# EAGLE design hardware (EAGLE 5.11)
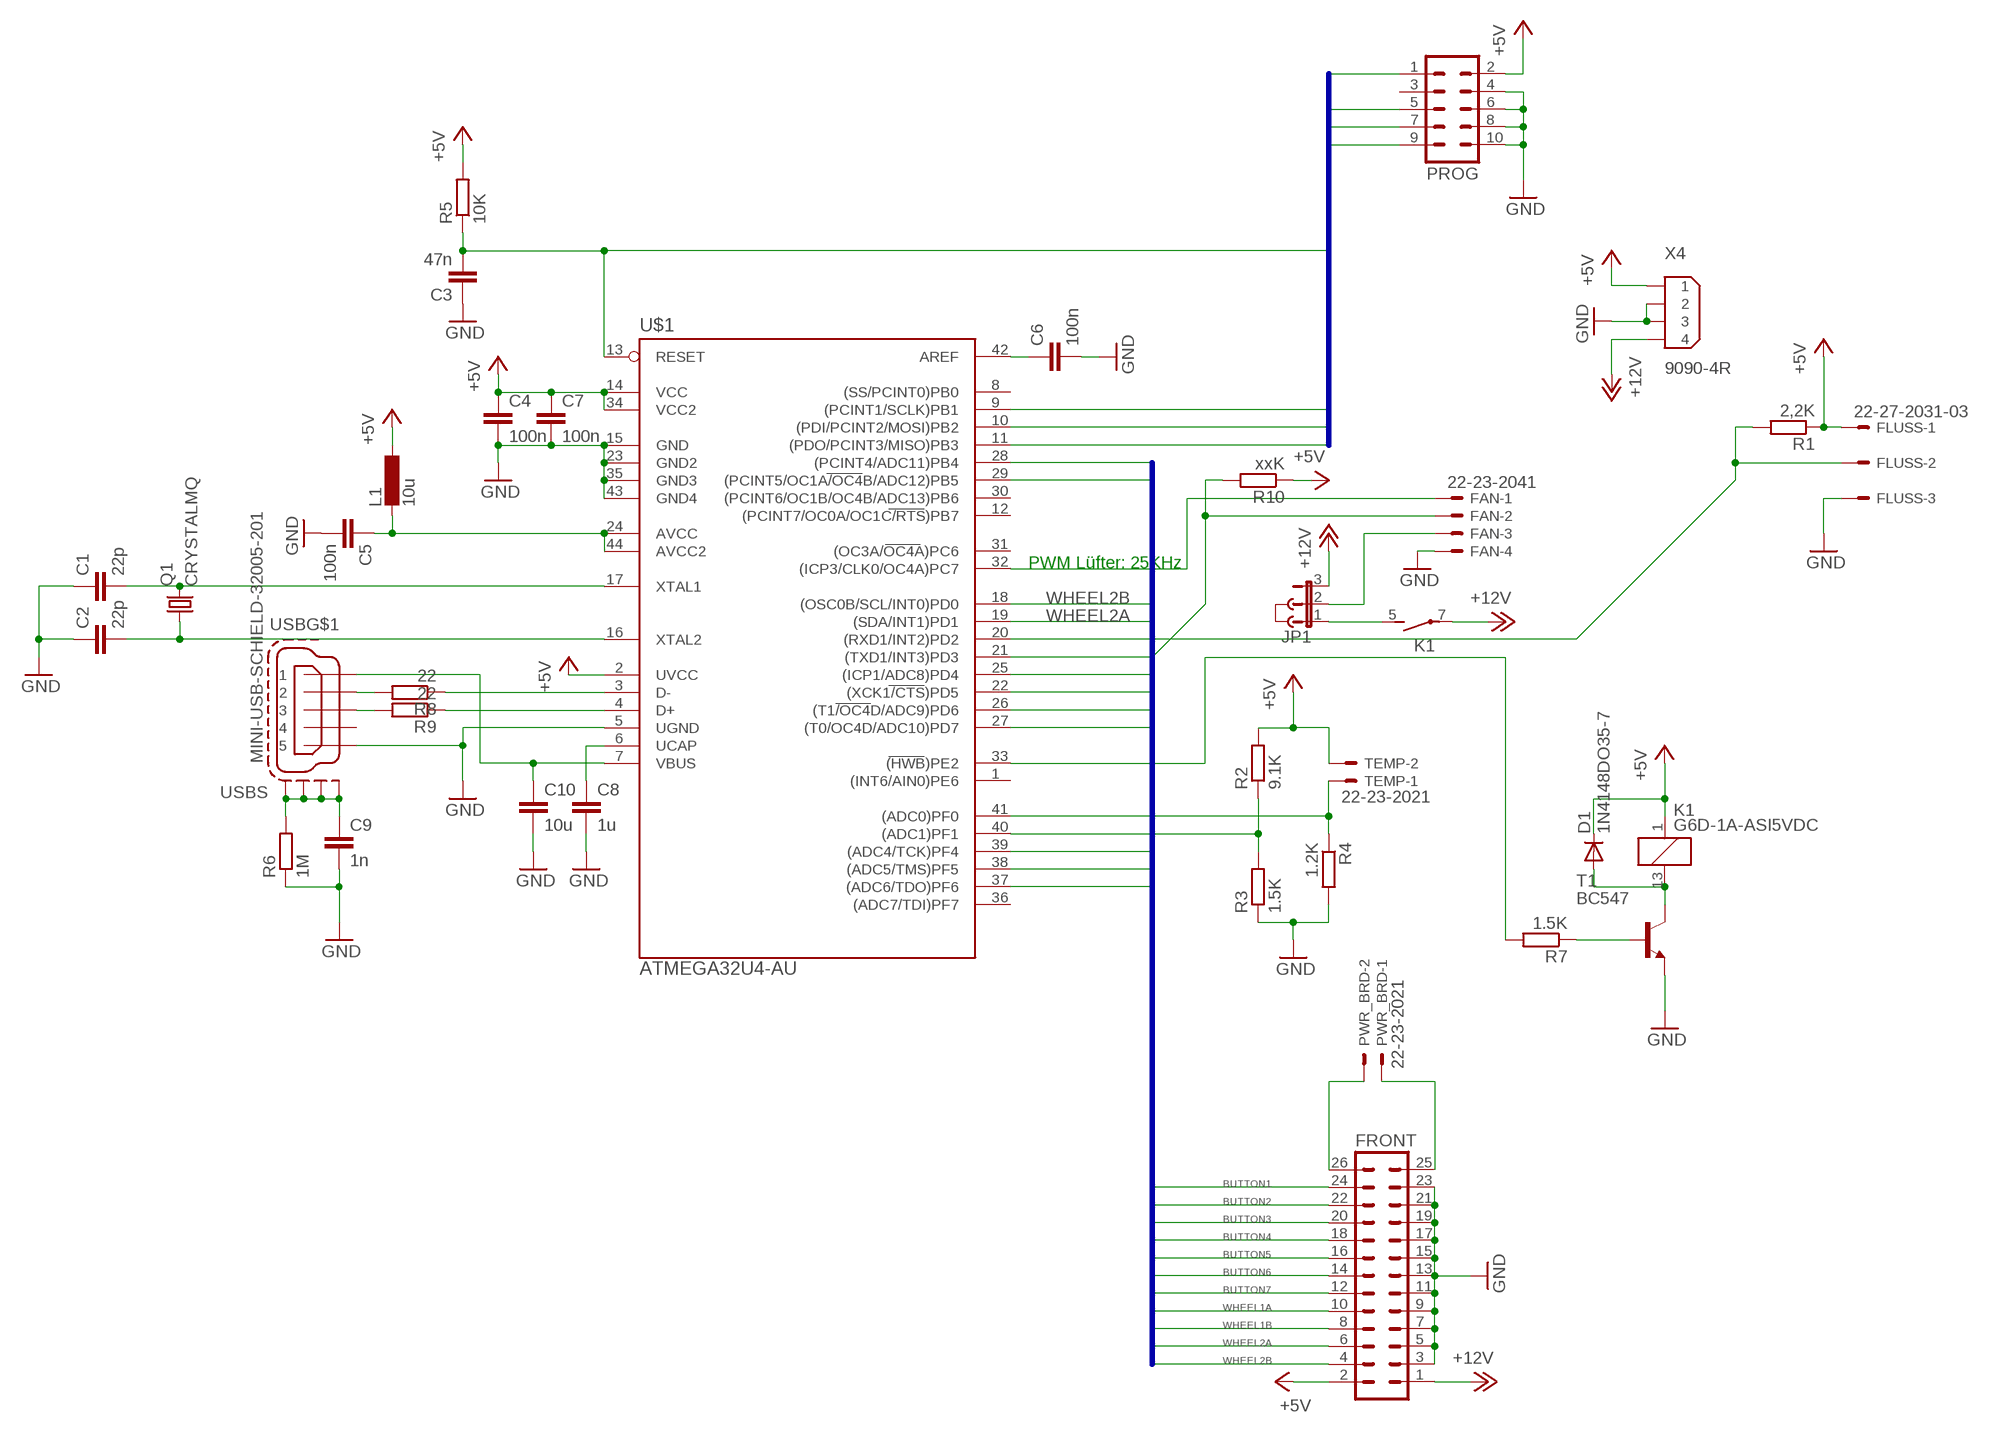
[diagram p0: schematic, sheet 1]

## Parts
C1  22p  C-EUC0603K  [C0603K]
C2  22p  C-EUC0603K  [C0603K]
C3  47n  C-EUC0603  [C0603]
C4  100n  C-EUC0603  [C0603]
C5  100n  C-EUC0603  [C0603]
C6  100n  C-EUC0603  [C0603]
C7  100n  C-EUC0603  [C0603]
C8  1u  C-EUC0603  [C0603]
C9  1n  C-EUC0603  [C0603]
C10  10u  C-EUC0603  [C0603]
D1  1N4148DO35-7  [DO35-7]
FAN  22-23-2041  [22-23-2041]
FLUSS  22-27-2031-03  [6410-03]
FRONT  ML26  [ML26]
J1  JUMPER  [JUMP]
JP1  JP2E  [JP2]
K1  G6D-1A-ASI5VDC  [G6D]
L1  10u  L-EUL2012C  [L2012C]
PROG  ML10  [ML10]
PWR_BRD  22-23-2021  [22-23-2021]
Q1  CRYSTALMQ  [MQ]
R1  2,2K  R-EU_R0603  [R0603]
R2  9.1K  R-EU_R0603  [R0603]
R3  1.5K  R-EU_R0603  [R0603]
R4  1.2K  R-EU_R0603  [R0603]
R5  10K  R-EU_R0603  [R0603]
R6  1M  R-EU_R0603  [R0603]
R7  1.5K  R-EU_R0603  [R0603]
R8  22  R-EU_R0603  [R0603]
R9  22  R-EU_R0603  [R0603]
R10  xxK  R-EU_R0603  [R0603]
T1  BC547  [TO92]
TEMP  22-23-2021  [22-23-2021]
U$1  ATMEGA32U4-AU  [TQFP44]
USB  MINI-USB-SCHIELD-32005-201  [32005-201]
X4  9090-4R  [9090-4R]

## Nets
+5V: C4.1 C7.1 D1.C FLUSS.1 FRONT.2 K1.1 L1.1 PROG.2 R1.1 R2.2 R5.2 R10.1 TEMP.2 U$1.2(UVCC) U$1.14(VCC) U$1.34(VCC2) X4.1
+12V: FRONT.1 JP1.3 K1.7(2:P) X4.4
BUTTON1: FRONT.24 U$1.39((ADC4/TCK)PF4)
BUTTON2: FRONT.22 U$1.38((ADC5/TMS)PF5)
BUTTON3: FRONT.20 U$1.37((ADC6/TDO)PF6)
BUTTON4: FRONT.18 U$1.27((T0/OC4D/ADC10)PD7)
BUTTON5: FRONT.16 U$1.26((T1/OC4D/ADC9)PD6)
BUTTON6: FRONT.14 U$1.25((ICP1/ADC8)PD4)
BUTTON7: FRONT.12 U$1.22((XCK1/CTS)PD5)
GND: C1.1 C2.1 C3.1 C4.2 C5.2 C6.2 C7.2 C8.2 C9.2 C10.2 FAN.4 FLUSS.3 FRONT.3 FRONT.5 FRONT.7 FRONT.9 FRONT.11 FRONT.13 FRONT.15 FRONT.17 FRONT.19 FRONT.21 FRONT.23 PROG.4 PROG.6 PROG.8 PROG.10 R3.1 R4.2 R6.1 T1.1(E) U$1.5(UGND) U$1.15(GND) U$1.23(GND2) U$1.35(GND3) U$1.43(GND4) USB.5 X4.2 X4.3
MISO: PROG.9 U$1.11((PDO/PCINT3/MISO)PB3)
MOSI: PROG.1 U$1.10((PDI/PCINT2/MOSI)PB2)
N$1: C1.2 Q1.P$3 U$1.17(XTAL1)
N$2: C2.2 Q1.P$1 U$1.16(XTAL2)
N$3: R4.1 TEMP.1 U$1.41((ADC0)PF0)
N$4: C5.1 L1.2 U$1.24(AVCC) U$1.44(AVCC2)
N$5: FAN.1 U$1.32((ICP3/CLK0/OC4A)PC7)
N$6: R2.1 R3.2 U$1.40((ADC1)PF1)
N$7: C6.1 U$1.42(AREF)
N$8: C9.1 R6.2 USB.M1(S:S1) USB.M2(S:S2) USB.M3(S:S3) USB.M4(S:S4)
N$9: C10.1 U$1.7(VBUS) USB.1
N$10: R8.2 USB.2
N$11: R9.2 USB.3
N$12: FAN.2 R10.2 U$1.21((TXD1/INT3)PD3)
N$13: C8.1 U$1.6(UCAP)
N$14: FLUSS.2 R1.2 U$1.20((RXD1/INT2)PD2)
N$15: FRONT.25 PWR_BRD.1
N$16: FRONT.26 PWR_BRD.2
N$17: R7.2 U$1.33((HWB)PE2)
N$18: R7.1 T1.2(B)
N$19: D1.A K1.13 T1.3(C)
N$20: FAN.3 JP1.2
N$21: JP1.1 K1.5(2:S)
N$22: R8.1 U$1.3(D-)
N$23: R9.1 U$1.4(D+)
RESET: C3.2 PROG.5 R5.1 U$1.13(RESET)
SCK: PROG.7 U$1.9((PCINT1/SCLK)PB1)
WHEEL1A: FRONT.10 U$1.28((PCINT4/ADC11)PB4)
WHEEL1B: FRONT.8 U$1.29((PCINT5/OC1A/OC4B/ADC12)PB5)
WHEEL2A: FRONT.6 U$1.19((SDA/INT1)PD1)
WHEEL2B: FRONT.4 U$1.18((OSC0B/SCL/INT0)PD0)
Unconnected: PROG.3 Q1.P$2(GND) Q1.P$4(GND1) U$1.1((INT6/AIN0)PE6) U$1.8((SS/PCINT0)PB0) U$1.12((PCINT7/OC0A/OC1C/RTS)PB7) U$1.30((PCINT6/OC1B/OC4B/ADC13)PB6) U$1.31((OC3A/OC4A)PC6) U$1.36((ADC7/TDI)PF7) USB.4

## Buses
PROGAMMIERADAPTER:MOSI,MISO,SCK,RESET
SCHALTER:WHEEL1A,WHEEL1B,WHEEL2A,WHEEL2B,BUTTON[1..7]

## Notes on the sheet
- PWM Lüfter: 25KHz

## Library data of the parts
C1-C10 = rcl:C-EU: CAPACITOR, European symbol
D1 = diode:1N4148: DIODE high speed (Philips)
FAN = con-molex:22-23-2041: .100" (2.54mm) Center Header - 4 Pin; MF: MOLEX; MPN: 22-23-2041; OC_FARNELL: 1462920; OC_NEWARK: 38C0355
FLUSS = con-molex:22-?-03: CONNECTOR wire to board 2.54 mm (.1 inch) pitch header; OC_FARNELL: unknown; OC_NEWARK: unknown
FRONT = con-harting-ml:ML26: HARTING; OC_FARNELL: unknown; OC_NEWARK: unknown
J1 = jumper:JUMPER: JUMPER header
JP1 = jumper:JP2E: JUMPER
K1 = relay:G6D?*: OMRON Slim, Miniature PCB Relay 17.5 × 6.5 × 12.5 mm with Socked Source: http://ecb.omron.com.sg/pdf/relay/power/G6D.pdf; OC_FARNELL: 9812660; OC_NEWARK: unknown
L1 = rcl:L-EU: INDUCTOR, European symbol
PROG = con-harting-ml:ML10: HARTING; OC_FARNELL: unknown; OC_NEWARK: unknown
PWR_BRD TEMP = con-molex:22-23-2021: .100" (2.54mm) Center Header - 2 Pin; MF: MOLEX; MPN: 22-23-2021; OC_FARNELL: 1462926; OC_NEWARK: 25C3832
Q1 = Crystals-new:CRYSTAL
R1-R10 = rcl:R-EU_: RESISTOR, European symbol
T1 = transistor:BC547: NPN TRANSISTOR
U$1 = mega32U4:ATMEGA32U4-AU
USB = con-cypressindustries:MINI-USB-SCHIELD-: MINI USB-B Conector Source: www.cypressindustries.com; OC_FARNELL: unknown; OC_NEWARK: unknown
X4 = con-thomas-betts:9090-4: Disk Drive Power four position Source: Thomas & Betts Electronic Interconnects Eiropean Edition 1998; OC_FARNELL: unknown; OC_NEWARK: unknown

## Board
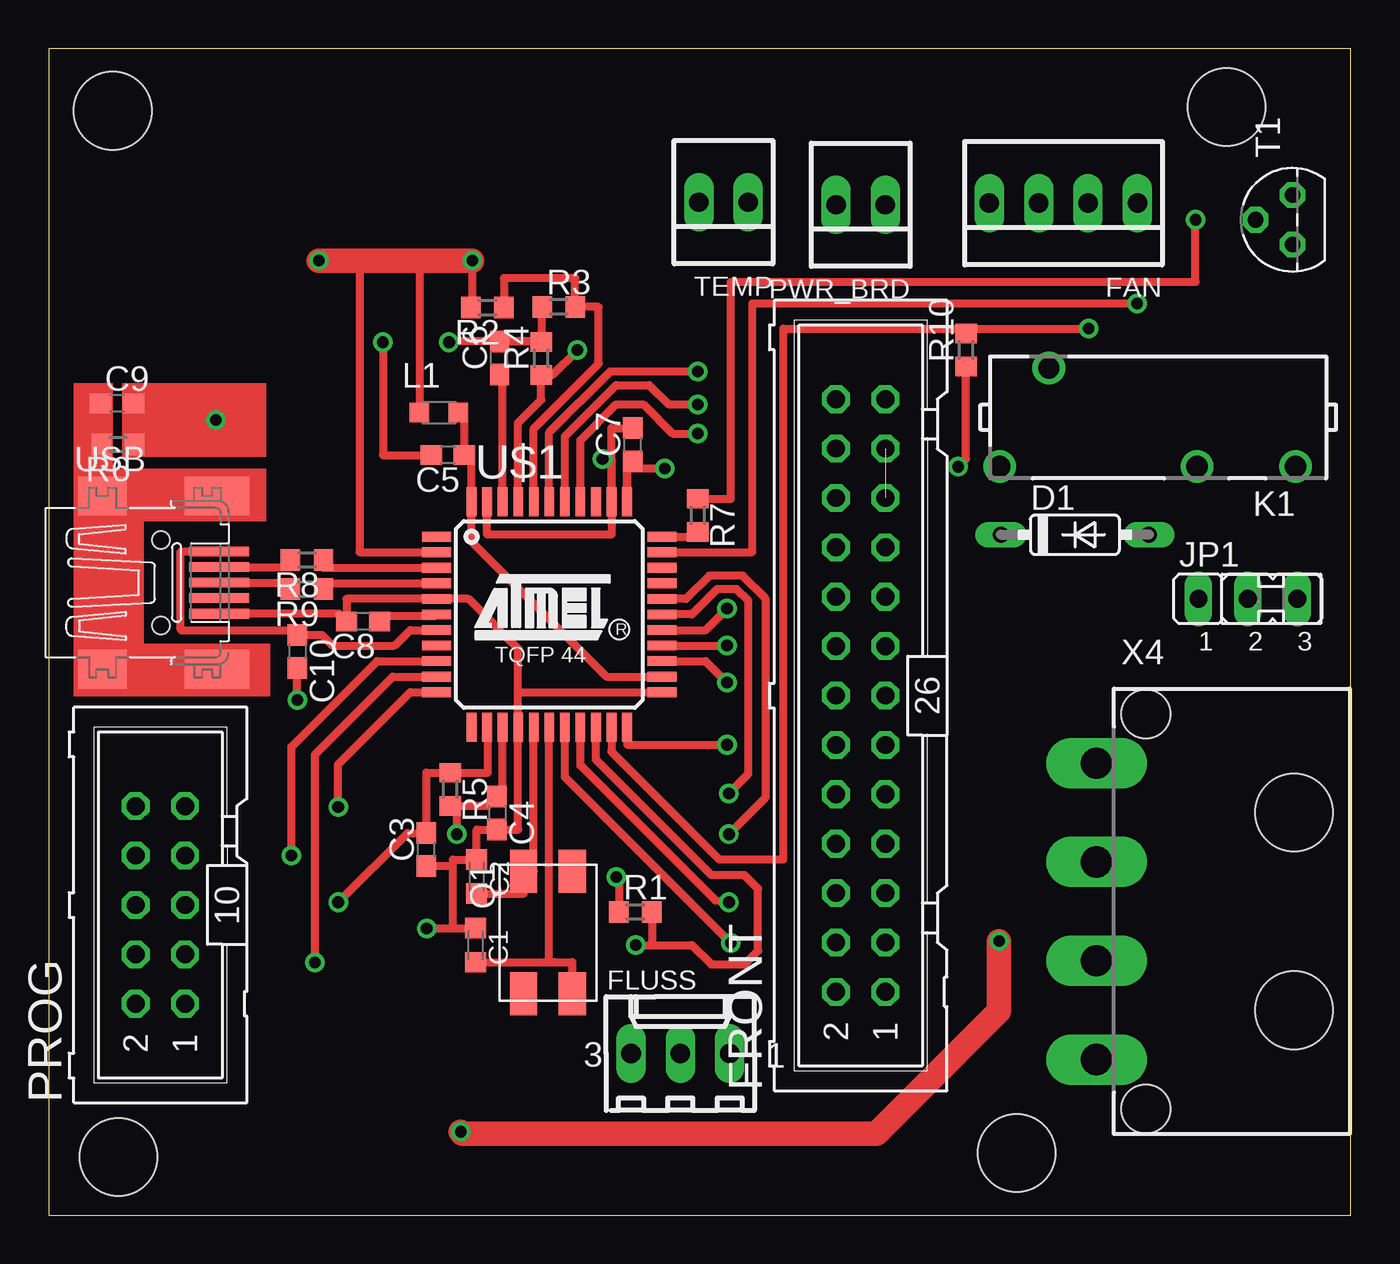
[diagram p1: board, top side]
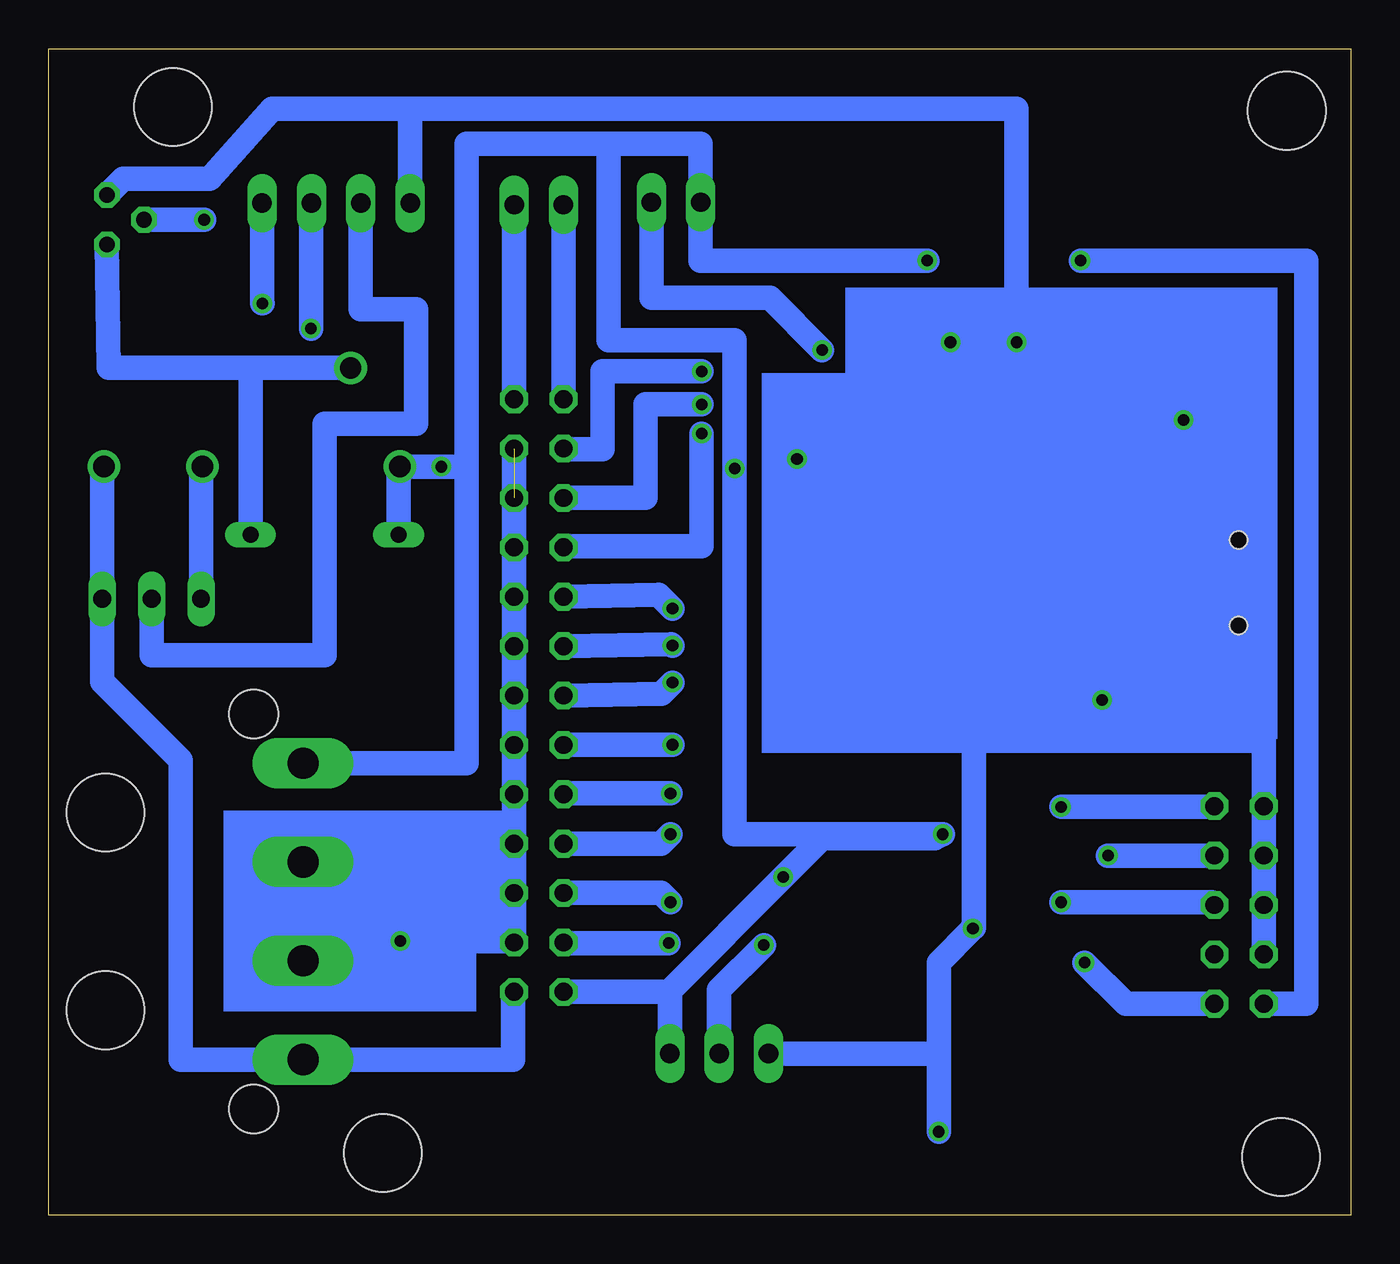
[diagram p2: board, bottom side, seen from below]

Size 67 x 60 mm. Coordinates in mm from the lower left corner, seen from the top.
Outline: 0,0 67,0 67,60 0,60 0,0
Copper layers (1*16): Top 0.035mm / dielectric 1.5mm / Bottom 0.035mm
Design rules "default *": minimum track width 10mil, minimum drill 12mil, track to track 6mil, track to pad 6mil, pad to pad 6mil, via to via 6mil, smd to smd 6mil, copper to edge 40mil, drill to drill 8mil, minimum pad ring 10mil, minimum via ring 8mil, stop-mask expansion 4mil, vias tented up to drill 0mil, thermal gap 10mil
Holes 4 mm at 3.6,3 49.8,3.2 60.6,57 3.3,56.8

### Footprints (pad centres in the part's own frame; a part is rotated, then mirrored left to right if it is on the bottom)
C0603K = smd 1.05 x 1.08: 1 -0.875,0; 2 0.875,0
C0603 = smd 1.1 x 1: 1 -0.85,0; 2 0.85,0
DO35-7 = drill 0.813 long: A 3.81,0; C -3.81,0
22-23-2041 = drill 1 long: 1 -3.81,0; 2 -1.27,0; 3 1.27,0; 4 3.81,0
6410-03 = drill 1.016 long: 1 2.54,0; 2 0,0; 3 -2.54,0
ML26 = drill 0.914 octagon: 1 -15.24,-1.27; 2 -15.24,1.27; 3 -12.7,-1.27; 4 -12.7,1.27; 5 -10.16,-1.27; 6 -10.16,1.27; 7 -7.62,-1.27; 8 -7.62,1.27; 9 -5.08,-1.27; 10 -5.08,1.27; 11 -2.54,-1.27; 12 -2.54,1.27; 13 0,-1.27; 14 0,1.27; 15 2.54,-1.27; 16 2.54,1.27; 17 5.08,-1.27; 18 5.08,1.27; 19 7.62,-1.27; 20 7.62,1.27; 21 10.16,-1.27; 22 10.16,1.27; 23 12.7,-1.27; 24 12.7,1.27; 25 15.24,-1.27; 26 15.24,1.27
JP2 = drill 0.914 long: 1 -2.54,0; 2 0,0; 3 2.54,0
G6D = drill 1.1 pad 1.676 round: 1 8.08,2.5; 5 -2.08,2.5; 7 -7.16,2.5; 13 5.54,-2.58
L2012C = smd 1 x 1: 1 -1,0; 2 1,0
ML10 = drill 0.914 octagon: 1 -5.08,-1.27; 2 -5.08,1.27; 3 -2.54,-1.27; 4 -2.54,1.27; 5 0,-1.27; 6 0,1.27; 7 2.54,-1.27; 8 2.54,1.27; 9 5.08,-1.27; 10 5.08,1.27
22-23-2021 = drill 1 long: 1 -1.27,0; 2 1.27,0
MQ = smd 2.2 x 1.4: P$1 -3.15,-1.25; P$2 3.15,-1.25; P$3 3.15,1.25; P$4 -3.15,1.25
R0603 = smd 1 x 1.1: 1 -0.85,0; 2 0.85,0
TO92 = drill 0.813 octagon: 1 1.27,0; 2 0,1.905; 3 -1.27,0
TQFP44 = smd 1.5 x 0.5: 1 -5.8,4; 2 -5.8,3.2; 3 -5.8,2.4; 4 -5.8,1.6; 5 -5.8,0.8; 6 -5.8,0; 7 -5.8,-0.8; 8 -5.8,-1.6; 9 -5.8,-2.4; 10 -5.8,-3.2; 11 -5.8,-4; 23 5.8,-4; 24 5.8,-3.2; 25 5.8,-2.4; 26 5.8,-1.6; 27 5.8,-0.8; 28 5.8,0; 29 5.8,0.8; 30 5.8,1.6; 31 5.8,2.4; 32 5.8,3.2; 33 5.8,4 | smd 0.5 x 1.5: 12 -4,-5.8; 13 -3.2,-5.8; 14 -2.4,-5.8; 15 -1.6,-5.8; 16 -0.8,-5.8; 17 0,-5.8; 18 0.8,-5.8; 19 1.6,-5.8; 20 2.4,-5.8; 21 3.2,-5.8; 22 4,-5.8; 34 4,5.8; 35 3.2,5.8; 36 2.4,5.8; 37 1.6,5.8; 38 0.8,5.8; 39 0,5.8; 40 -0.8,5.8; 41 -1.6,5.8; 42 -2.4,5.8; 43 -3.2,5.8; 44 -4,5.8
32005-201 = smd 3.1 x 0.5: 1 3,1.6; 2 3,0.8; 3 3,0; 4 3,-0.8; 5 3,-1.6 | smd 2.5 x 2: M1 -3,-4.45; M2 -3,4.45 | smd 3.3 x 2: M3 2.9,4.45; M4 2.9,-4.45 | hole 0.9: 0,2.2; 0,-2.2
9090-4R = drill 1.6 pad 2.6 long: 1 -7.62,-6.35; 2 -2.54,-6.35; 3 2.54,-6.35; 4 7.62,-6.35 | hole 4: -5.08,3.81; 5.08,3.81 | hole 2.5: -10.16,-3.81; 10.16,-3.81

### Placement (x,y rotation side)
C1  21.97,13.89 270 top
C2  22.03,17.42 270 top
C3  19.44,18.81 90 top
C4  23.07,20.69 270 top
C5  20.54,39.1 180 top
C6  23.2,44.09 90 top
C7  30.06,39.63 90 top
C8  16.18,30.54 180 top
C9  3.51,41.76 0 top
C10  12.8,29 270 top
D1  52.8,35 0 top
FAN  52.21,52.05 180 top
FLUSS  32.5,8.32 0 top
FRONT  41.78,26.73 90 top
J1  62.9,31.7 90 top
JP1  61.7,31.7 0 top
K1  57,41 180 top
L1  20.08,41.29 0 top
PROG  5.75,15.96 90 top
PWR_BRD  41.78,51.97 180 top
Q1  25.69,14.54 270 top
R1  30.19,15.6 0 top
R2  22.57,46.68 180 top
R3  26.24,46.72 0 top
R4  25.34,44.07 90 top
R5  20.66,21.91 270 top
R6  3.57,39.64 180 top
R7  33.4,36 270 top
R8  13.3,33.7 180 top
R9  13.3,32.2 180 top
R10  47.2,44.5 90 top
T1  64,51.2 90 top
TEMP  34.72,52.1 180 top
U$1  25.76,30.9 0 top
USB  5.78,32.54 0 top
X4  60.26,15.63 270 top

### Tracks (layer width: path | path; a pad name or v marks a point on that pad's centre or on a via)
+5V  (via drill 0.6)
  Top 0.406: U$1.14 23.36,21.73 C4.1 22.59,21.06 R5.2 21,20.62 v21,19.6 | C7.1 29.76,38.78 U$1.34 29.76,38.4 v31.7,38.4 | v21.8,49.1 21.8,46.68 R2.2 | R1.1 29.34,17.26 v29.2,17.4 | U$1.2 16,34.1 16,49.1 | L1.1 19.08,49.1 18.9,49.1 | v46.8,38.5 47.2,38.9 R10.1
  Top 1.27: v13.9,49.1 16,49.1 18.9,49.1 v21.8,49.1
  Bottom 1.27: v21.8,49.1 33.45,49.1 TEMP.2 33.45,55.1 38.2,55.1 | 35.04,11.56 FLUSS.1 | 35.04,11.56 v29.2,17.4 27.2,19.4 21.4,19.4 v21,19.6 31.7,19.6 v31.7,38.4 31.7,45 38.2,45 38.2,55.1 | FRONT.2 35.11,11.49 35.04,11.56 | 38.2,55.1 45.5,55.1 45.5,38.5 | PROG.2 2.3,10.88 2.3,49.1 v13.9,49.1 | D1.C 48.99,38.5 K1.1 v46.8,38.5 45.5,38.5 | X4.1 45.5,23.25 45.5,38.5
+12V
  Bottom 1.27: FRONT.1 43.1,11.5 43.1,8.01 X4.4 60.2,8.01 60.2,23.4 64.24,27.44 JP1.3 64.24,38.5 K1.7
BUTTON1  (via drill 0.6)
  Top 0.406: U$1.39 25.76,40.26 28.9,43.4 v33.4,43.4
  Bottom 1.27: v33.4,43.4 38.5,43.4 38.5,39.4 40.51,39.4 FRONT.24
BUTTON2  (via drill 0.6)
  Top 0.406: U$1.38 26.56,40.06 29.2,42.7 30.9,42.7 31.9,41.7 v33.4,41.7
  Bottom 1.27: FRONT.22 36.3,36.9 36.3,41.7 v33.4,41.7
BUTTON3  (via drill 0.6)
  Top 0.406: U$1.37 27.36,39.86 29.2,41.7 30.6,41.7 32.1,40.2 v33.4,40.2
  Bottom 1.27: FRONT.20 40.46,34.4 33.4,34.4 v33.4,40.2
BUTTON4  (via drill 0.6)
  Top 0.406: U$1.27 33.8,30.1 v34.9,31.2
  Bottom 1.27: v34.9,31.2 35.61,31.91 FRONT.18
BUTTON5  (via drill 0.6)
  Top 0.406: U$1.26 v34.9,29.3
  Bottom 1.27: v34.9,29.3 34.97,29.37 FRONT.16
BUTTON6  (via drill 0.6)
  Top 0.406: U$1.25 33.8,28.5 v34.9,27.4
  Bottom 1.27: v34.9,27.4 35.47,26.83 FRONT.14
BUTTON7  (via drill 0.6)
  Top 0.406: U$1.22 29.76,24.2 v34.9,24.2
  Bottom 1.27: v34.9,24.2 v34.9,24.19 FRONT.12
GND  (via drill 0.6)  (1 unrouted)
  Top 0.406: 20.8,14.77 C1.1 | 20.8,17.96 20.8,18.3 C2.1 22.03,19.84 C4.2 24.16,19.84 U$1.15 24.16,26.9 | 20.8,17.96 C3.1 | 20.8,14.77 20.8,17.96 | U$1.43 22.56,35 28.96,35 U$1.35 | C6.2 23.22,44.92 R4.2 25.39,44.97 | 25.39,44.97 R3.1 | 25.39,44.97 20.6,44.97 v20.6,44.9 | v28.5,38.9 28.96,38.9 U$1.35 | C7.2 28.96,40.48 U$1.35 | 24.16,26.9 U$1.23 | USB.5 14.93,30.94 C8.2 15.33,31.7 U$1.5 21.6,31.7 24.16,29.14 24.16,26.9 | C5.2 17.2,39.1 v17.2,44.9 | 20.8,14.77 19.45,14.77 v19.45,14.75 | C9.2 4.42,41.76 R6.1 8.6,39.64 v8.6,40.9 | v12.8,26.5 C10.2
  Top 1.27: v48.9,14.1 48.9,10.5 42.6,4.2 21.3,4.2 v21.2,4.3
  Bottom 1.27: v28.5,38.9 22.5,44.9 v20.6,44.9 v17.2,44.9 | 21.2,8.32 FLUSS.3 | FRONT.23 FRONT.19 FRONT.17 FRONT.15 FRONT.13 | FRONT.13 FRONT.11 FRONT.9 FRONT.7 | 43.05,18.1 FRONT.5 FRONT.3 | FRONT.7 43.05,18.1 | X4.3 X4.2 54.41,18.1 43.05,18.1 | v17.2,44.9 17.2,56.9 48.4,56.9 | v19.45,14.75 19.4,14.8 19.4,24.7 | v19.45,14.75 19.5,14.7 | 19.5,14.7 21.2,13 21.2,8.32 | 11.3,24.7 4.48,24.7 PROG.10 PROG.8 PROG.6 PROG.4 | 11.3,24.7 19.4,24.7 | v19.45,14.75 19.5,14.75 19.5,14.7 | 17.2,40.9 v8.6,40.9 | 19.4,24.7 19.4,40.9 17.2,40.9 | 17.2,40.9 v17.2,44.9 | FRONT.7 43.05,19.27 | T1.1 63.17,53.3 58.7,53.3 55.5,56.9 48.4,56.9 | FRONT.13 43.05,14.1 v48.9,14.1 | 21.2,8.32 v21.2,4.3 | v12.8,26.5 11.3,25 11.3,24.7 | 48.4,56.9 FAN.4
MISO  (via drill 0.6)
  Top 0.406: U$1.11 18.6,26.9 14.9,23.2 v14.9,21
  Bottom 1.27: v14.9,21 7.06,21 PROG.9
MOSI  (via drill 0.6)
  Top 0.406: U$1.10 17.7,27.7 13.7,23.7 v13.7,13
  Bottom 1.27: v13.7,13 11.58,10.88 PROG.1
N$1
  Top 0.406: Q1.P$3 26.94,13.02 26,13.02 25.76,13.02 | C1.2 25.76,13.02 | 25.76,13.02 U$1.17
N$2
  Top 0.406: U$1.16 24.96,17.69 Q1.P$1 24.44,16.55 C2.2
N$3  (via drill 0.6)
  Top 0.406: U$1.41 24.16,40.76 25.34,41.94 R4.1 25.92,43.22 v27.2,44.5
  Bottom 1.27: v27.2,44.5 29.9,47.2 35.99,47.2 TEMP.1
N$4
  Top 0.406: L1.2 21.39,41.29 C5.1 21.76,39 U$1.44 21.76,34.64 28.7,27.7 U$1.24
N$5  (via drill 0.6)
  Top 0.406: U$1.32 36.2,34.1 36.2,46.9 v56,46.9
  Bottom 1.27: FAN.1 56.02,46.9 v56,46.9
N$6
  Top 0.406: U$1.40 24.96,40.46 28.3,43.8 28.3,46.72 R3.2 27.09,48.2 23.42,48.2 R2.1
N$7
  Top 0.406: U$1.42 23.36,43.24 C6.1
N$8
  Top 0.406: USB.M4 USB.M1 USB.M2 | USB.M2 USB.M3 | USB.M2 2.72,36.99 R6.2 2.66,39.64 C9.1
N$9
  Top 0.406: USB.1 6.8,34.14 6.8,30.1 12.55,30.1 C10.1 14.05,29.85 14.6,29.3 17.8,29.3 18.6,30.1 U$1.7
N$10
  Top 0.406: USB.2 12.45,33.34 R8.2
N$11
  Top 0.406: USB.3 12.45,32.54 R9.2
N$12  (via drill 0.6)
  Top 0.406: 47.4,45.6 37.8,45.6 37.8,18.3 34.5,18.3 28.96,23.84 U$1.21 | 47.4,45.6 v53.5,45.6 | R10.2 47.4,45.55 47.4,45.6
  Bottom 1.27: FAN.2 53.48,45.6 v53.5,45.6
N$13
  Top 0.406: U$1.6 19.9,30.84 17.03,30.84 C8.1
N$14  (via drill 0.6)
  Top 0.406: v30.2,13.9 31.04,13.9 | R1.2 31.04,13.9 | 31.04,13.9 33.1,13.9 34.1,12.9 35.8,12.9 36.5,13.6 36.5,16.8 35.8,17.5 34.1,17.5 28.16,23.44 U$1.20
  Bottom 1.27: 32.5,8.3 FLUSS.2 32.5,11.6 v30.2,13.9
N$15
  Bottom 1.27: PWR_BRD.1 FRONT.25
N$16
  Bottom 1.27: PWR_BRD.2 FRONT.26
N$17
  Top 0.406: U$1.33 33.4,34.9 R7.2
N$18  (via drill 0.6)
  Top 0.406: R7.1 35.1,36.85 35.1,48 59,48 v59,51.2
  Bottom 1.27: v59,51.2 T1.2
N$19
  Bottom 1.27: D1.A 56.61,43.58 | 56.61,43.58 K1.13 | T1.3 63.9,43.58 56.61,43.58
N$20
  Bottom 1.27: JP1.2 61.7,28.8 52.8,28.8 52.8,40.7 48.1,40.7 48.1,46.6 50.94,46.6 FAN.3
N$21
  Bottom 1.27: K1.5 59.16,38.5 JP1.1
N$22
  Top 0.406: R8.1 14.15,33.3 U$1.3
N$23
  Top 0.406: R9.1 14.15,32.5 U$1.4
RESET  (via drill 0.6)
  Top 0.406: U$1.13 22.6,25.1 22.6,22.76 R5.1 19.44,22.76 C3.2 18.46,19.66 v14.9,16.1
  Bottom 1.27: v14.9,16.1 7.16,16.1 PROG.5
SCK  (via drill 0.6)
  Top 0.406: U$1.9 16.9,28.5 12.5,24.1 v12.5,18.5
  Bottom 1.27: PROG.7 v12.5,18.5
WHEEL1A  (via drill 0.6)
  Top 0.406: v35,21.7 36,22.7 36,31.6 35.4,32.2 34.4,32.2 33.1,30.9 U$1.28
  Bottom 1.27: v35,21.7 40.46,21.7 FRONT.10
WHEEL1B  (via drill 0.6)
  Top 0.406: v35,19.6 36.9,21.5 36.9,31.7 35.7,32.9 34,32.9 32.8,31.7 U$1.29
  Bottom 1.27: FRONT.8 35.5,19.1 v35,19.6
WHEEL2A  (via drill 0.6)
  Top 0.406: U$1.19 27.36,23.14 34.3,16.2 v35,16.1
  Bottom 1.27: FRONT.6 40.48,16.6 35.5,16.6 v35,16.1
WHEEL2B  (via drill 0.6)
  Top 0.406: U$1.18 26.56,22.54 v35.1,14
  Bottom 1.27: v35.1,14 40.48,14 FRONT.4
(copper drawn outside any net)
  shapes: Bottom area x7, Top area x5